# EAGLE schematic synth-a-phone-v1.0 (EAGLE 5.11)
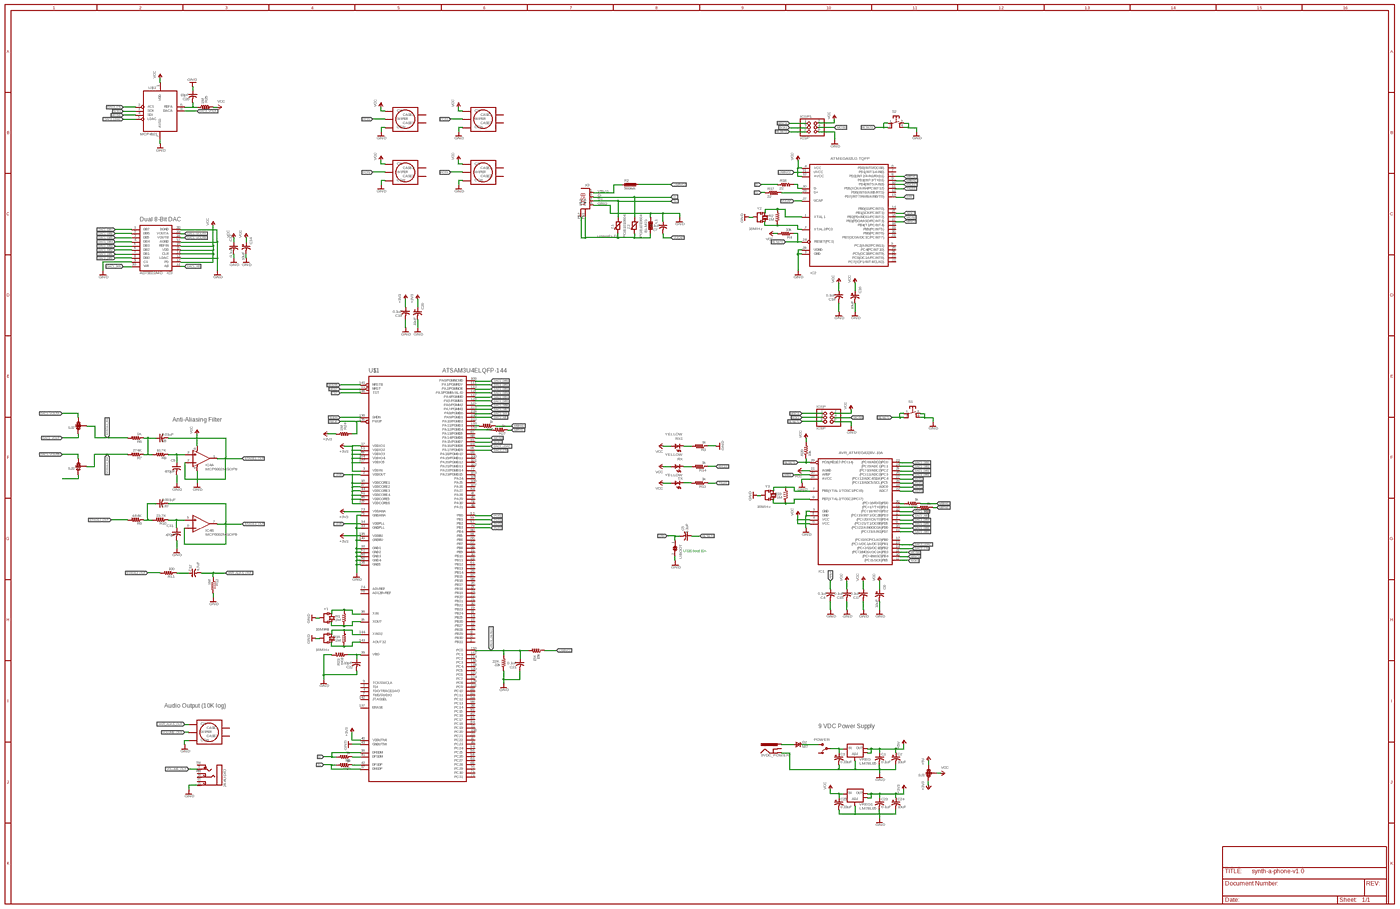
[diagram p0: schematic, sheet 1, overview]
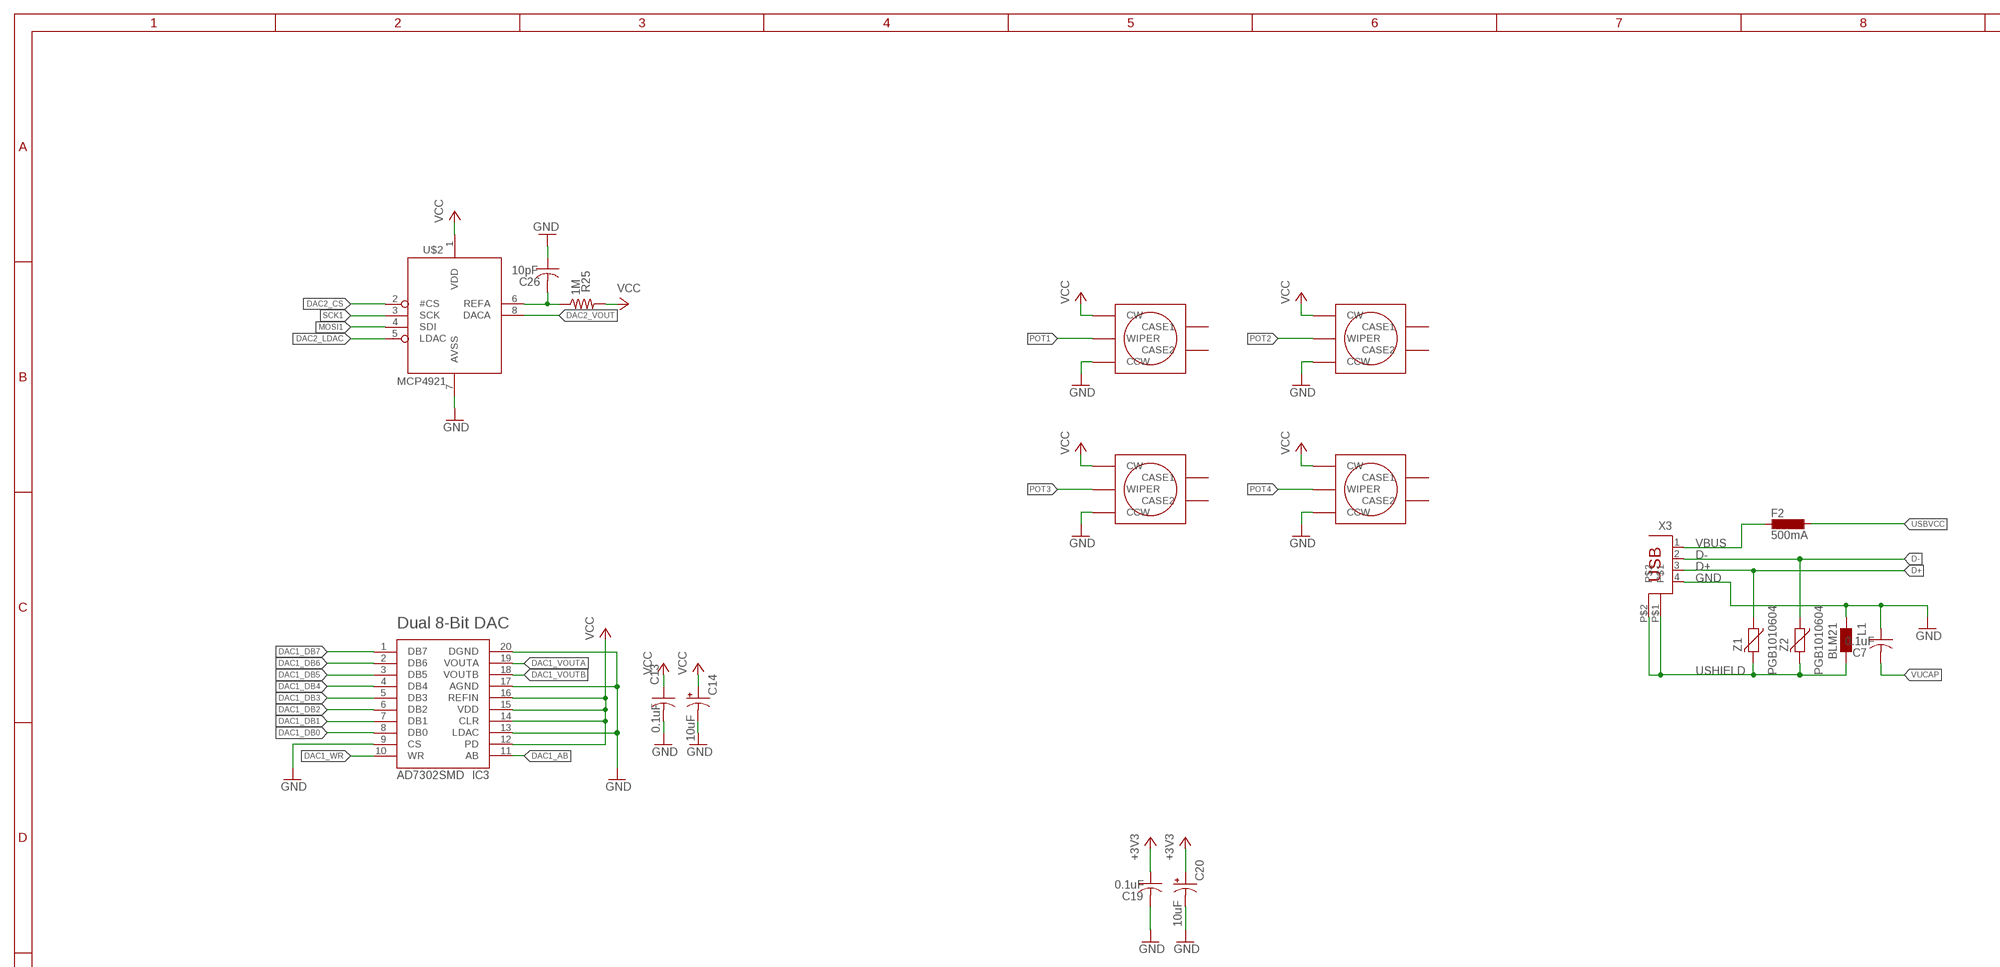
[diagram p1: schematic, sheet 1, part 1 of 4]
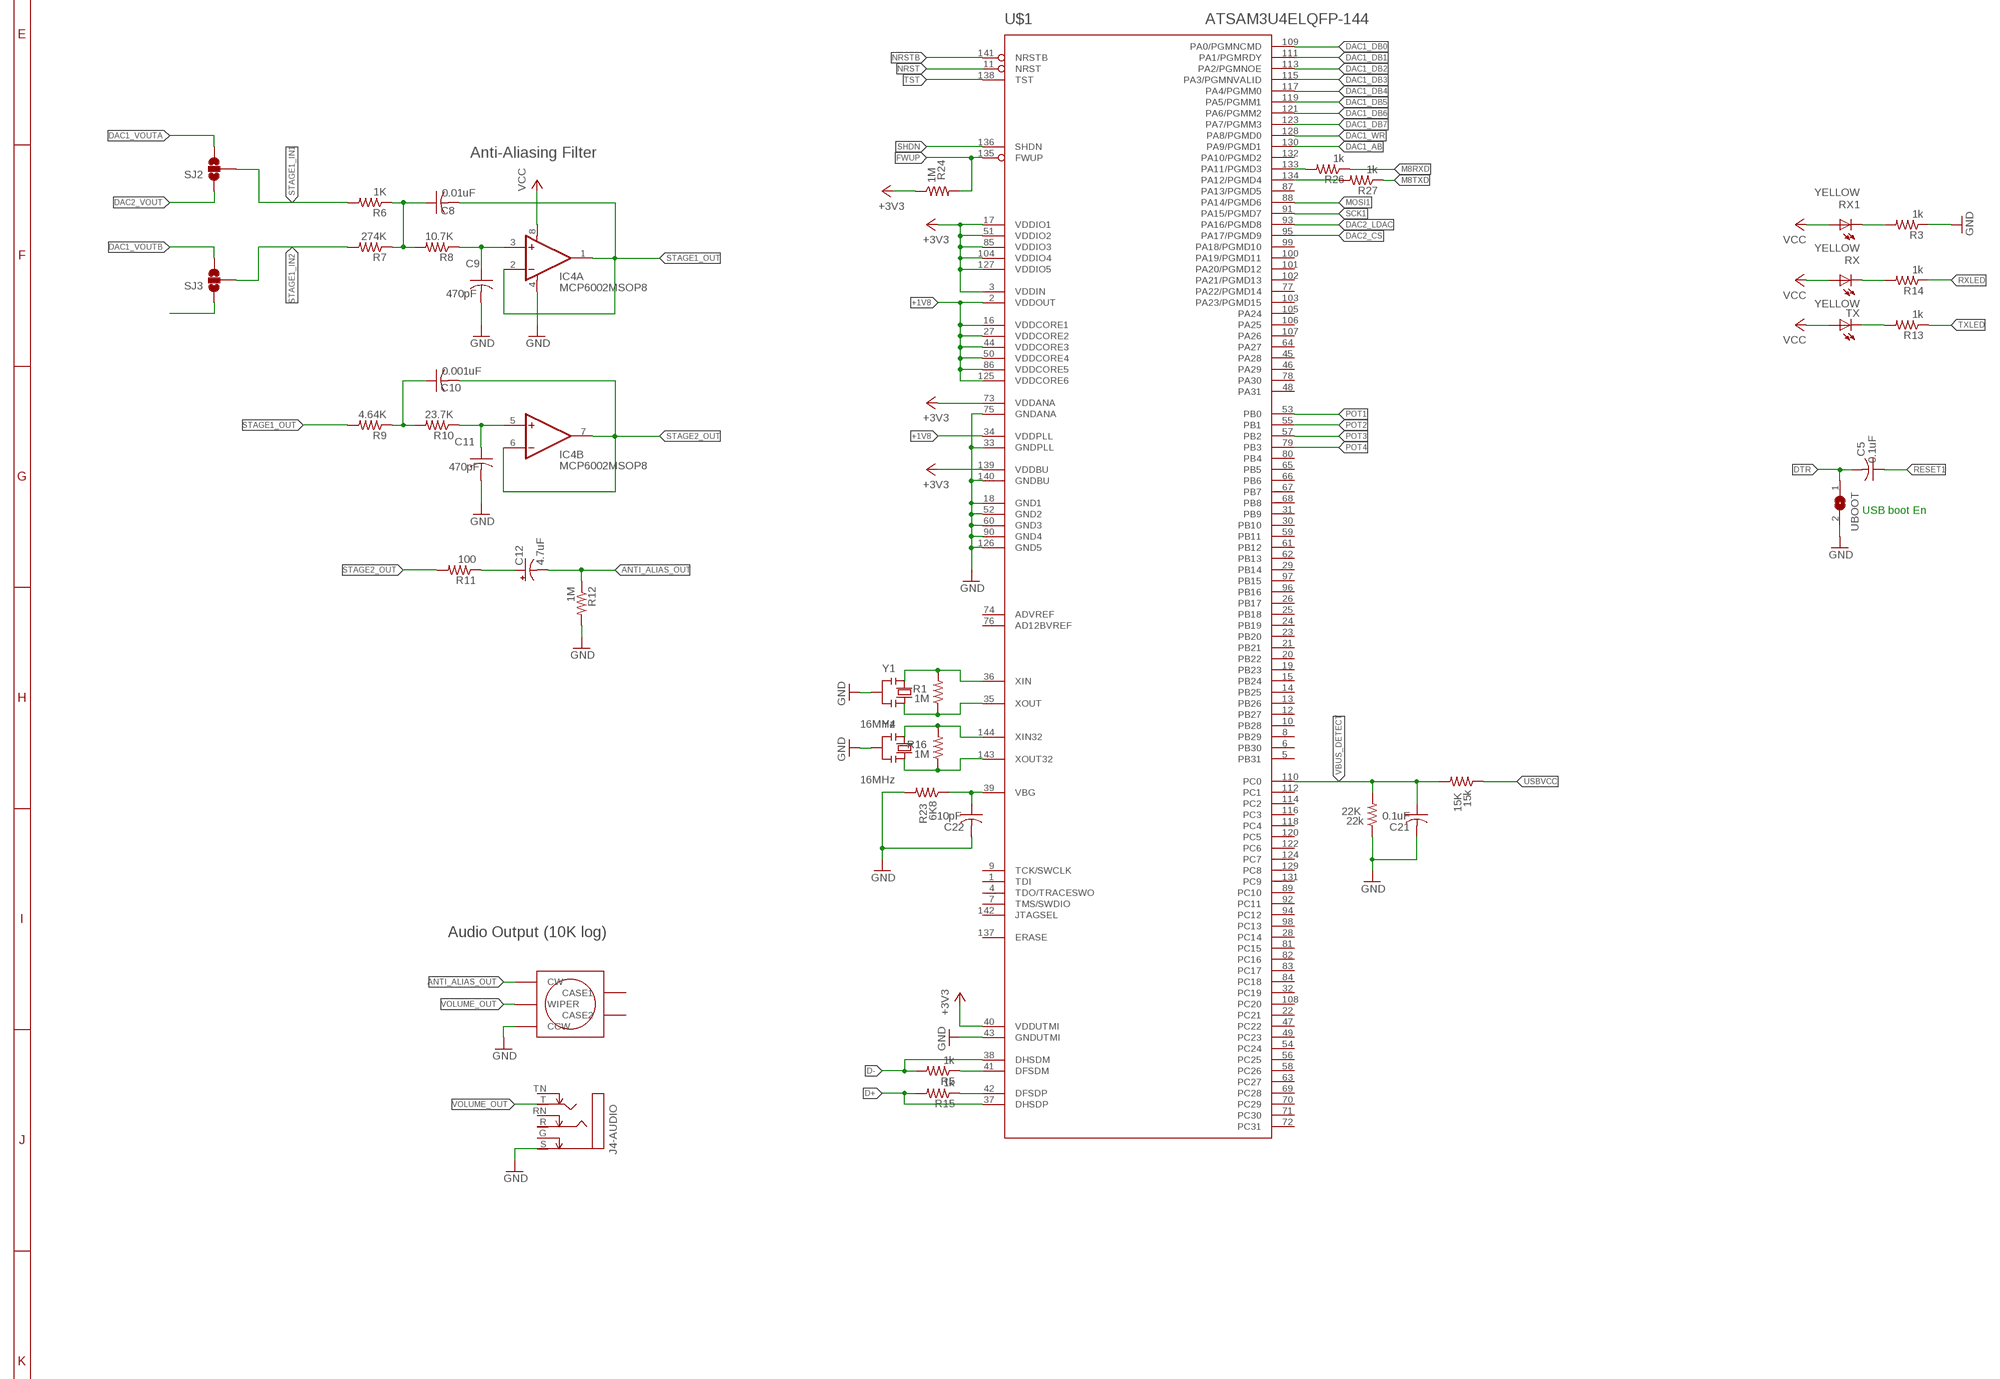
[diagram p2: schematic, sheet 1, part 2 of 4]
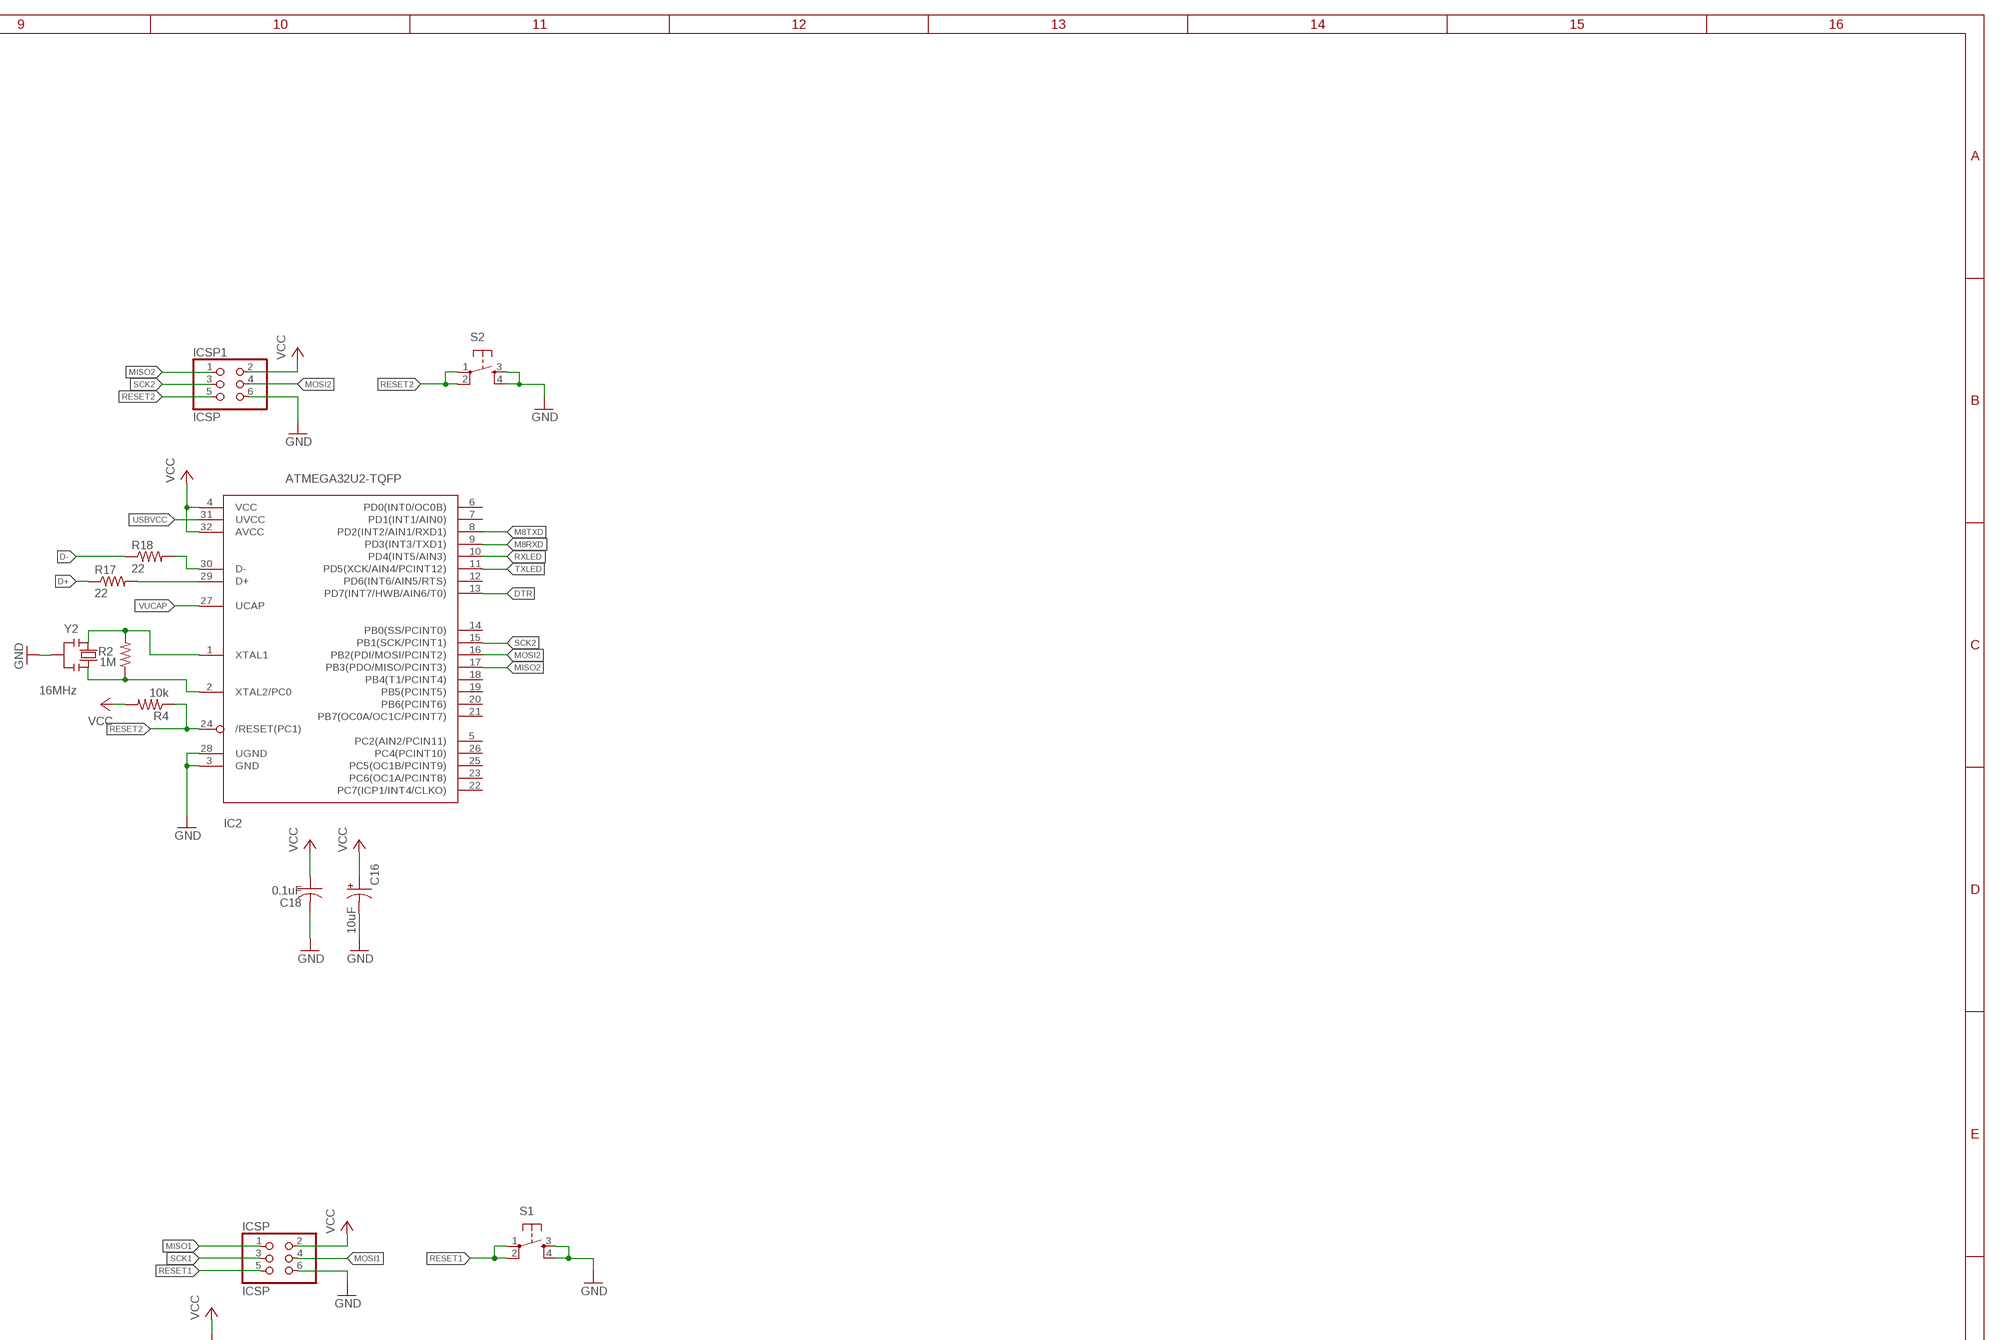
[diagram p3: schematic, sheet 1, part 3 of 4]
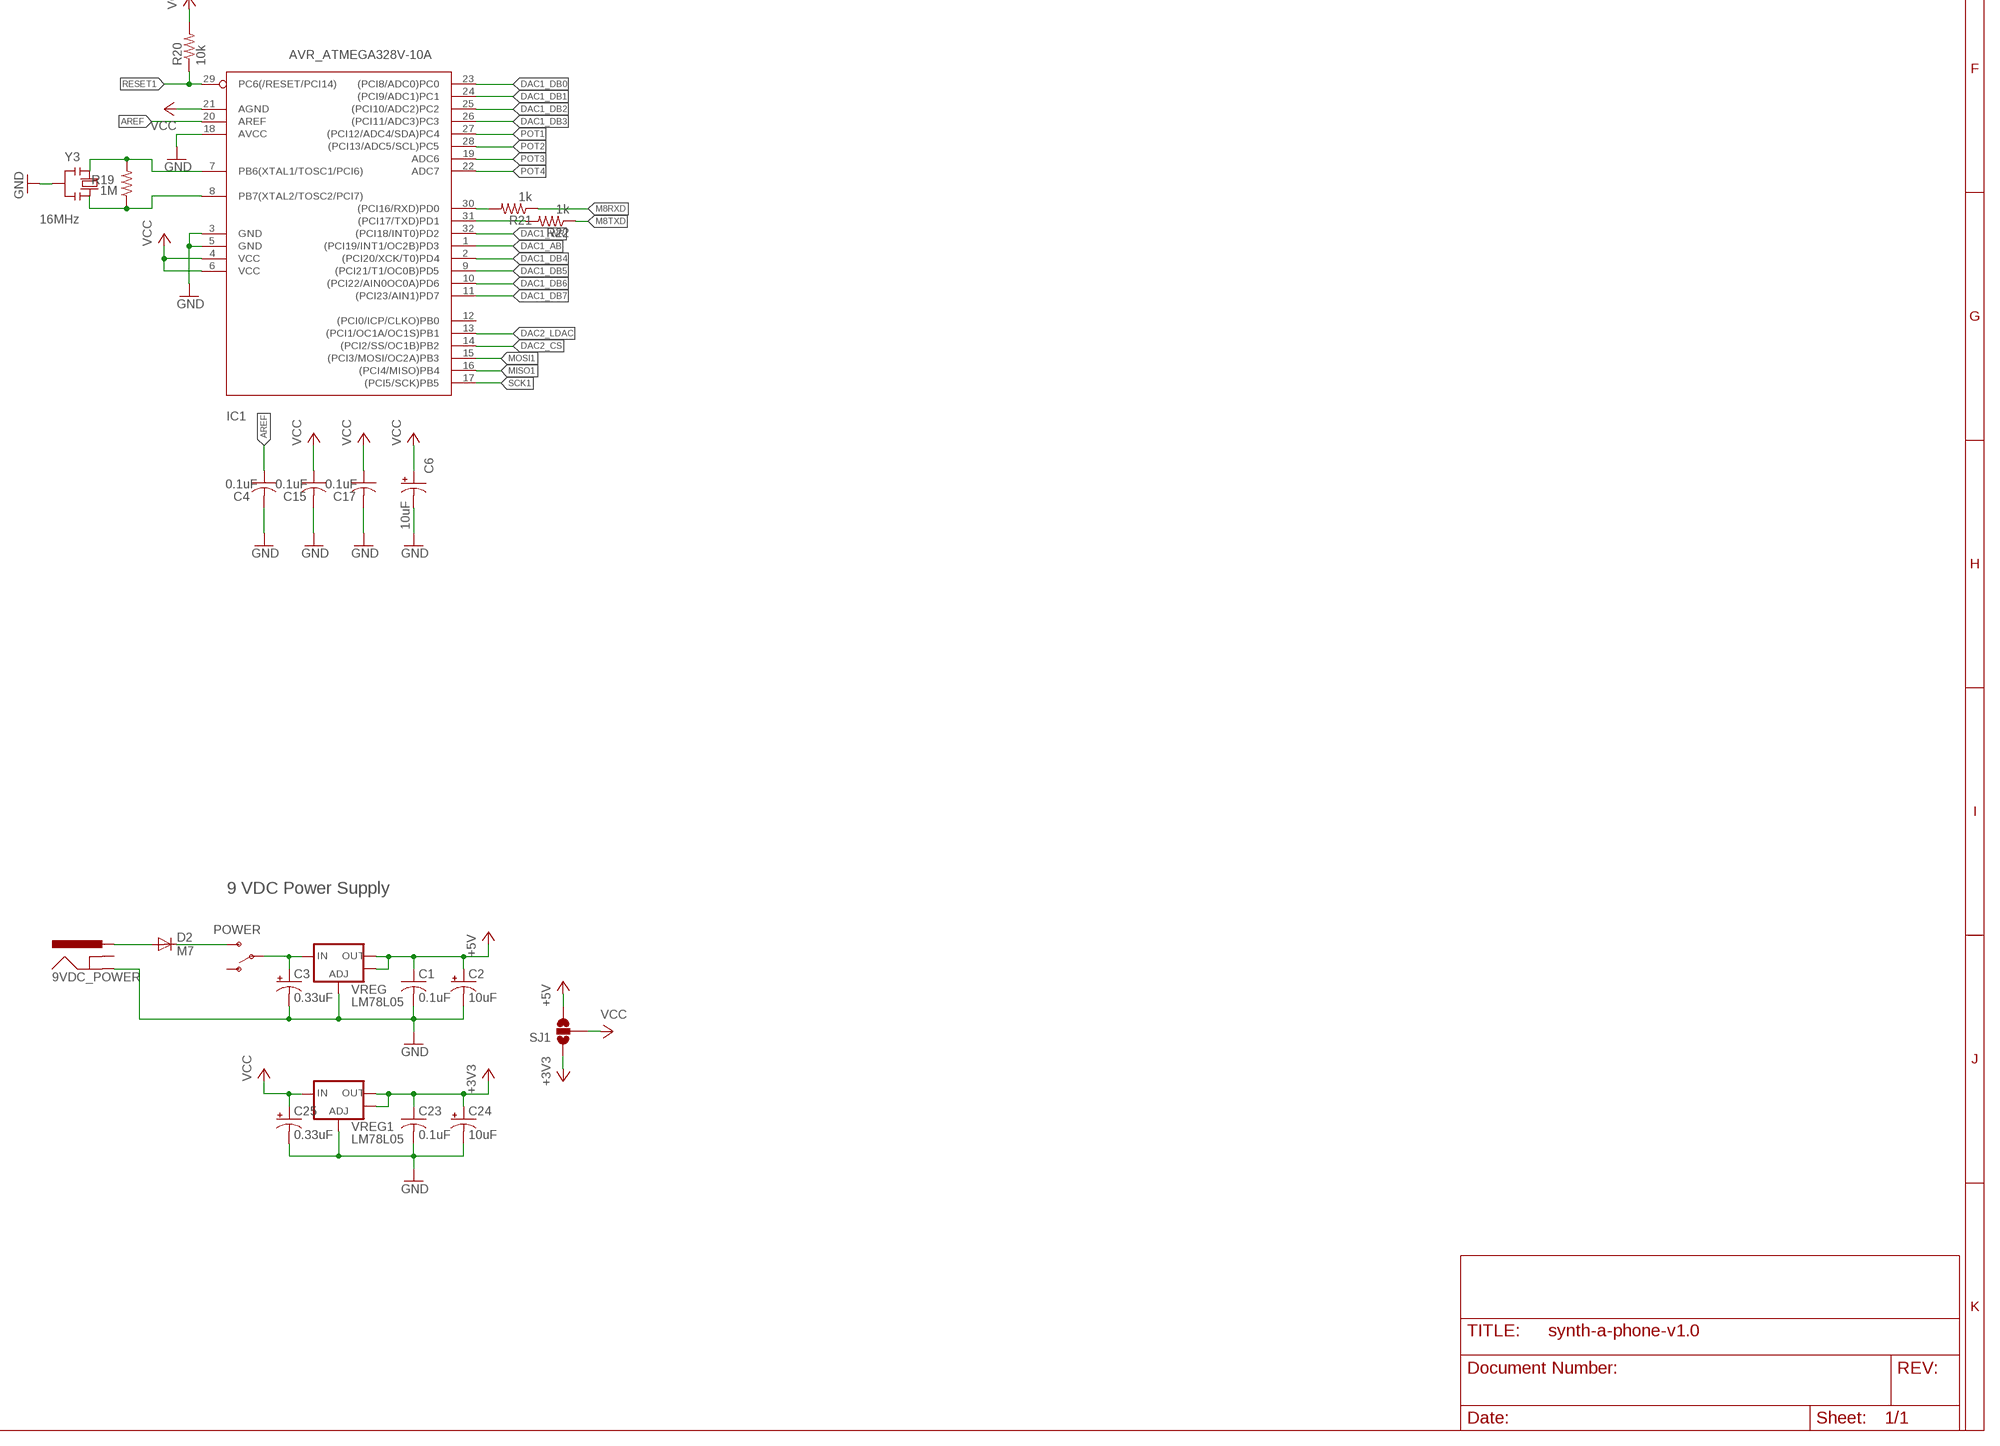
[diagram p4: schematic, sheet 1, part 4 of 4]

## Parts
9VDC_POWER  POWER_JACKPTH  [POWER_JACK_PTH]
15K  15k  R-US_R0603  [R0603]
22K  22k  R-US_R0603  [R0603]
C1  0.1uF  C-USC0603  [C0603]
C2  10uF  CPOL-USSMCA  [SMC_A]
C3  0.33uF  CPOL-USSMCA  [SMC_A]
C4  0.1uF  C-USC0603  [C0603]
C5  0.1uF  C-USC0603  [C0603]
C6  10uF  CPOL-USSMCA  [SMC_A]
C7  0.1uF  C-USC0603  [C0603]
C8  0.01uF  C-USC0603  [C0603]
C9  470pF  C-USC0603  [C0603]
C10  0.001uF  C-USC0603  [C0603]
C11  470pF  C-USC0603  [C0603]
C12  4.7uF  CPOL-USSMCA  [SMC_A]
C13  0.1uF  C-USC0603  [C0603]
C14  10uF  CPOL-USSMCA  [SMC_A]
C15  0.1uF  C-USC0603  [C0603]
C16  10uF  CPOL-USSMCA  [SMC_A]
C17  0.1uF  C-USC0603  [C0603]
C18  0.1uF  C-USC0603  [C0603]
C19  0.1uF  C-USC0603  [C0603]
C20  10uF  CPOL-USSMCA  [SMC_A]
C21  0.1uF  C-USC0603  [C0603]
C22  10pF  C-USC0603  [C0603]
C23  0.1uF  C-USC0603  [C0603]
C24  10uF  CPOL-USSMCA  [SMC_A]
C25  0.33uF  CPOL-USSMCA  [SMC_A]
C26  10pF  C-USC0603  [C0603]
D2  M7  DIODE-SMB  [SMB]
F2  500mA  L-EUL1812  [L1812]
IC1  AVR_ATMEGA328V-10A  [AVR_TQFP32-08]
IC2  ATMEGA32U2-TQFP  [TQFP32-08]
IC3  AD7302SMD  [TSSOP20]
IC4  MCP6002MSOP8  [MSOP8]
ICSP  ICSP  PINHD-2X3  [2X03]
ICSP1  ICSP  PINHD-2X3  [2X03]
J4-AUDIO  STEREOSWL  [NRJ6HF-1]
L1  BLM21  WE-CBF_0805  [0805]
POWER  SPST  SWITCH-SPSTPTH  [SWITCH-SPDT]
R1  1M  R-US_R0603  [R0603]
R2  1M  R-US_R0603  [R0603]
R3  1k  R-US_R0603  [R0603]
R4  10k  R-US_R0603  [R0603]
R5  1k  R-US_R0603  [R0603]
R6  1K  R-US_R0603  [R0603]
R7  274K  R-US_R0603  [R0603]
R8  10.7K  R-US_R0603  [R0603]
R9  4.64K  R-US_R0603  [R0603]
R10  23.7K  R-US_R0603  [R0603]
R11  100  R-US_R0603  [R0603]
R12  1M  R-US_R0603  [R0603]
R13  1k  R-US_R0603  [R0603]
R14  1k  R-US_R0603  [R0603]
R15  1k  R-US_R0603  [R0603]
R16  1M  R-US_R0603  [R0603]
R17  22  R-US_R0603  [R0603]
R18  22  R-US_R0603  [R0603]
R19  1M  R-US_R0603  [R0603]
R20  10k  R-US_R0603  [R0603]
R21  1k  R-US_R0603  [R0603]
R22  1k  R-US_R0603  [R0603]
R23  6K8  R-US_R0603  [R0603]
R24  1M  R-US_R0603  [R0603]
R25  1M  R-US_R0603  [R0603]
R26  1k  R-US_R0603  [R0603]
R27  1k  R-US_R0603  [R0603]
RX  YELLOW  LEDCHIP-LED0805  [CHIP-LED0805]
RX1  YELLOW  LEDCHIP-LED0805  [CHIP-LED0805]
S1  TAC_SWITCHPTH  [TACTILE-PTH]
S2  TAC_SWITCHPTH  [TACTILE-PTH]
SJ1  SOLDERJUMPER_2WAYS  [SJ_3]
SJ2  SOLDERJUMPER_2WAYS  [SJ_3]
SJ3  SOLDERJUMPER_2WAYS  [SJ_3]
TX  YELLOW  LEDCHIP-LED0805  [CHIP-LED0805]
U$1  ATSAM3U4ELQFP-144  [SQFP-S-20X20-144]
U$2  MCP4921MSOP8  [MSOP8]
UBOOT  SJ  [SJ]
VOLUME  Volume  VACOLOCO_EVUFRK09_POT  [VACOLOCO_EVUF]
VOLUME1  Volume  VACOLOCO_EVUFRK09_POT  [VACOLOCO_EVUF]
VOLUME2  Volume  VACOLOCO_EVUFRK09_POT  [VACOLOCO_EVUF]
VOLUME3  Volume  VACOLOCO_EVUFRK09_POT  [VACOLOCO_EVUF]
VOLUME4  Volume  VACOLOCO_EVUFRK09_POT  [VACOLOCO_EVUF]
VREG  LM78L05  V_REG_LM1117SOT223  [SOT223]
VREG1  LM78L05  V_REG_LM1117SOT223  [SOT223]
X3  PN61729  [PN61729]
Y1  16MHz  RESONATORMU  [RESONATOR]
Y2  16MHz  RESONATORMU  [RESONATOR]
Y3  16MHz  RESONATORMU  [RESONATOR]
Y4  16MHz  RESONATORMU  [RESONATOR]
Z1  PGB1010604  VARISTORCN0603  [CT/CN0603]
Z2  PGB1010604  VARISTORCN0603  [CT/CN0603]

## Nets
+1V8: U$1.2(VDDOUT) U$1.16(VDDCORE1) U$1.27(VDDCORE2) U$1.34(VDDPLL) U$1.44(VDDCORE3) U$1.50(VDDCORE4) U$1.86(VDDCORE5) U$1.125(VDDCORE6)
+3V3: C19.1 C20.+ C23.1 C24.+ R24.1 SJ1.1 U$1.3(VDDIN) U$1.17(VDDIO1) U$1.40(VDDUTMI) U$1.51(VDDIO2) U$1.73(VDDANA) U$1.85(VDDIO3) U$1.104(VDDIO4) U$1.127(VDDIO5) U$1.139(VDDBU) VREG1.2(OUT) VREG1.4(OUT)
+5V: C1.1 C2.+ SJ1.3 VREG.2(OUT) VREG.4(OUT)
ANTI_ALIAS_OUT: C12.- R12.1 VOLUME.CW
AREF: C4.1 IC1.20(AREF)
D+: R15.2 R17.1 U$1.37(DHSDP) X3.3 Z1.1
D-: R5.2 R18.1 U$1.38(DHSDM) X3.2 Z2.1
DAC1_AB: IC1.1((PCI19/INT1/OC2B)PD3) IC3.11(AB) U$1.130(PA9/PGMD1)
DAC1_DB0: IC1.23((PCI8/ADC0)PC0) IC3.8(DB0) U$1.109(PA0/PGMNCMD)
DAC1_DB1: IC1.24((PCI9/ADC1)PC1) IC3.7(DB1) U$1.111(PA1/PGMRDY)
DAC1_DB2: IC1.25((PCI10/ADC2)PC2) IC3.6(DB2) U$1.113(PA2/PGMNOE)
DAC1_DB3: IC1.26((PCI11/ADC3)PC3) IC3.5(DB3) U$1.115(PA3/PGMNVALID)
DAC1_DB4: IC1.2((PCI20/XCK/T0)PD4) IC3.4(DB4) U$1.117(PA4/PGMM0)
DAC1_DB5: IC1.9((PCI21/T1/OC0B)PD5) IC3.3(DB5) U$1.119(PA5/PGMM1)
DAC1_DB6: IC1.10((PCI22/AIN0OC0A)PD6) IC3.2(DB6) U$1.121(PA6/PGMM2)
DAC1_DB7: IC1.11((PCI23/AIN1)PD7) IC3.1(DB7) U$1.123(PA7/PGMM3)
DAC1_VOUTA: IC3.19(VOUTA) SJ2.3
DAC1_VOUTB: IC3.18(VOUTB) SJ3.3
DAC1_WR: IC1.32((PCI18/INT0)PD2) IC3.10(WR) U$1.128(PA8/PGMD0)
DAC2_CS: IC1.14((PCI2/SS/OC1B)PB2) U$1.95(PA17/PGMD9) U$2.2(#CS)
DAC2_LDAC: IC1.13((PCI1/OC1A/OC1S)PB1) U$1.93(PA16/PGMD8) U$2.5(LDAC)
DAC2_VOUT: SJ2.1 U$2.8(DACA)
DTR: C5.2 IC2.13(PD7(INT7/HWB/AIN6/T0)) UBOOT.1
FWUP: R24.2 U$1.135(FWUP)
GND: 9VDC_POWER.GND 22K.1 C1.2 C2.- C3.- C4.2 C6.- C7.1 C9.2 C11.2 C13.2 C14.- C15.2 C16.- C17.2 C18.2 C19.2 C20.- C21.2 C22.2 C23.2 C24.- C25.- C26.1 IC1.3(GND) IC1.5(GND) IC1.18(AVCC) IC2.3(GND) IC2.28(UGND) IC3.9(CS) IC3.13(LDAC) IC3.17(AGND) IC3.20(DGND) IC4.4(A:V-) ICSP1.6 ICSP.6 J4-AUDIO.S L1.1 R3.1 R12.2 R23.2 S1.3 S1.4 S2.3 S2.4 U$1.18(GND1) U$1.33(GNDPLL) U$1.43(GNDUTMI) U$1.52(GND2) U$1.60(GND3) U$1.75(GNDANA) U$1.90(GND4) U$1.126(GND5) U$1.140(GNDBU) U$2.7(AVSS) UBOOT.2 VOLUME1.CCW VOLUME2.CCW VOLUME3.CCW VOLUME4.CCW VOLUME.CCW VREG1.1(ADJ) VREG.1(ADJ) X3.4 Y1.2 Y2.2 Y3.2 Y4.2
M8RXD: IC2.9(PD3(INT3/TXD1)) R21.1 R26.1
M8TXD: IC2.8(PD2(INT2/AIN1/RXD1)) R22.1 R27.1
MISO1: IC1.16((PCI4/MISO)PB4) ICSP.1
MISO2: IC2.17(PB3(PDO/MISO/PCINT3)) ICSP1.1
MOSI1: IC1.15((PCI3/MOSI/OC2A)PB3) ICSP.4 U$1.88(PA14/PGMD6) U$2.4(SDI)
MOSI2: IC2.16(PB2(PDI/MOSI/PCINT2)) ICSP1.4
N$1: R5.1 U$1.41(DFSDM)
N$2: R15.1 U$1.42(DFSDP)
N$3: R14.2 RX.C
N$4: R13.2 TX.C
N$5: C22.1 R23.1 U$1.39(VBG)
N$6: R3.2 RX1.C
N$7: R26.2 U$1.133(PA11/PGMD3)
N$8: IC1.30((PCI16/RXD)PD0) R21.2
N$9: IC1.31((PCI17/TXD)PD1) R22.2
N$10: R27.2 U$1.134(PA12/PGMD4)
N$12: SJ3.1
N$15: C26.2 R25.1 U$2.6(REFA)
N$21: C12.+ R11.1
N$25: 9VDC_POWER.PWR D2.A
N$27: C3.+ POWER.2(P) VREG.3(IN)
N$42: D2.C POWER.3(S)
N$69: C8.1 R6.1 R7.1 R8.2
N$71: C9.1 IC4.3(A:+IN) R8.1
N$73: C10.1 R9.1 R10.2
N$74: C11.1 IC4.5(B:+IN) R10.1
NRST: U$1.11(NRST)
NRSTB: U$1.141(NRSTB)
POT1: IC1.27((PCI12/ADC4/SDA)PC4) U$1.53(PB0) VOLUME4.WIPER
POT2: IC1.28((PCI13/ADC5/SCL)PC5) U$1.55(PB1) VOLUME2.WIPER
POT3: IC1.19(ADC6) U$1.57(PB2) VOLUME3.WIPER
POT4: IC1.22(ADC7) U$1.79(PB3) VOLUME1.WIPER
RD+: IC2.29(D+) R17.2
RD-: IC2.30(D-) R18.2
RESET1: C5.1 IC1.29(PC6(/RESET/PCI14)) ICSP.5 R20.1 S1.1 S1.2
RESET2: IC2.24(/RESET(PC1)) ICSP1.5 R4.1 S2.1 S2.2
RXLED: IC2.10(PD4(INT5/AIN3)) R14.1
SCK1: IC1.17((PCI5/SCK)PB5) ICSP.3 U$1.91(PA15/PGMD7) U$2.3(SCK)
SCK2: IC2.15(PB1(SCK/PCINT1)) ICSP1.3
SHDN: U$1.136(SHDN)
STAGE1_IN1: R6.2 SJ2.2
STAGE1_IN2: R7.2 SJ3.2
STAGE1_OUT: C8.2 IC4.1(A:OUT) IC4.2(A:-IN) R9.2
STAGE2_OUT: C10.2 IC4.6(B:-IN) IC4.7(B:OUT) R11.2
TST: U$1.138(TST)
TXLED: IC2.11(PD5(XCK/AIN4/PCINT12)) R13.1
USBVCC: 15K.1 F2.1 IC2.31(UVCC)
USHIELD: L1.2 X3.P$1 X3.P$2 Z1.2 Z2.2
VBUS: F2.2 X3.1
VBUS_DETECT: 15K.2 22K.2 C21.1 U$1.110(PC0)
VCC: C6.+ C13.1 C14.+ C15.1 C16.+ C17.1 C18.1 C25.+ IC1.4(VCC) IC1.6(VCC) IC1.21(AGND) IC2.4(VCC) IC2.32(AVCC) IC3.12(PD) IC3.14(CLR) IC3.15(VDD) IC3.16(REFIN) IC4.8(A:V+) ICSP1.2 ICSP.2 R4.2 R20.2 R25.2 RX1.A RX.A SJ1.2 TX.A VOLUME1.CW VOLUME2.CW VOLUME3.CW VOLUME4.CW VREG1.3(IN)
VDD: U$2.1(VDD) ; supply symbol labelled VCC
VOLUME_OUT: J4-AUDIO.T VOLUME.WIPER
VUCAP: C7.2 IC2.27(UCAP)
XTAL1: IC2.1(XTAL1) R2.2 Y2.1
XTAL2: IC2.2(XTAL2/PC0) R2.1 Y2.3
XTAL3: R1.2 U$1.36(XIN) Y1.1
XTAL4: R1.1 U$1.35(XOUT) Y1.3
XTAL5: IC1.7(PB6(XTAL1/TOSC1/PCI6)) R19.2 Y3.1
XTAL6: IC1.8(PB7(XTAL2/TOSC2/PCI7)) R19.1 Y3.3
XTAL7: R16.2 U$1.144(XIN32) Y4.1
XTAL8: R16.1 U$1.143(XOUT32) Y4.3
Unconnected: 9VDC_POWER.GNDBREAK IC1.12((PCI0/ICP/CLKO)PB0) IC2.5(PC2(AIN2/PCIN11)) IC2.6(PD0(INT0/OC0B)) IC2.7(PD1(INT1/AIN0)) IC2.12(PD6(INT6/AIN5/RTS)) IC2.14(PB0(SS/PCINT0)) IC2.18(PB4(T1/PCINT4)) IC2.19(PB5(PCINT5)) IC2.20(PB6(PCINT6)) IC2.21(PB7(OC0A/OC1C/PCINT7)) IC2.22(PC7(ICP1/INT4/CLKO)) IC2.23(PC6(OC1A/PCINT8)) IC2.25(PC5(OC1B/PCINT9)) IC2.26(PC4(PCINT10)) J4-AUDIO.G(SN) J4-AUDIO.R J4-AUDIO.RN J4-AUDIO.TN POWER.1(O) U$1.1(TDI) U$1.4(TDO/TRACESWO) U$1.5(PB31) U$1.6(PB30) U$1.7(TMS/SWDIO) U$1.8(PB29) U$1.9(TCK/SWCLK) U$1.10(PB28) U$1.12(PB27) U$1.13(PB26) U$1.14(PB25) U$1.15(PB24) U$1.19(PB23) U$1.20(PB22) U$1.21(PB21) U$1.22(PC21) U$1.23(PB20) U$1.24(PB19) U$1.25(PB18) U$1.26(PB17) U$1.28(PC14) U$1.29(PB14) U$1.30(PB10) U$1.31(PB9) U$1.32(PC19) U$1.45(PA28) U$1.46(PA29) U$1.47(PC22) U$1.48(PA31) U$1.49(PC23) U$1.54(PC24) U$1.56(PC25) U$1.58(PC26) U$1.59(PB11) U$1.61(PB12) U$1.62(PB13) U$1.63(PC27) U$1.64(PA27) U$1.65(PB5) U$1.66(PB6) U$1.67(PB7) U$1.68(PB8) U$1.69(PC28) U$1.70(PC29) U$1.71(PC30) U$1.72(PC31) U$1.74(ADVREF) U$1.76(AD12BVREF) U$1.77(PA22/PGMD14) U$1.78(PA30) U$1.80(PB4) U$1.81(PC15) U$1.82(PC16) U$1.83(PC17) U$1.84(PC18) U$1.87(PA13/PGMD5) U$1.89(PC10) U$1.92(PC11) U$1.94(PC12) U$1.96(PB16) U$1.97(PB15) U$1.98(PC13) U$1.99(PA18/PGMD10) U$1.100(PA19/PGMD11) U$1.101(PA20/PGMD12) U$1.102(PA21/PGMD13) U$1.103(PA23/PGMD15) U$1.105(PA24) U$1.106(PA25) U$1.107(PA26) U$1.108(PC20) U$1.112(PC1) U$1.114(PC2) U$1.116(PC3) U$1.118(PC4) U$1.120(PC5) U$1.122(PC6) U$1.124(PC7) U$1.129(PC8) U$1.131(PC9) U$1.132(PA10/PGMD2) U$1.137(ERASE) U$1.142(JTAGSEL) VOLUME1.CASE1 VOLUME1.CASE2 VOLUME2.CASE1 VOLUME2.CASE2 VOLUME3.CASE1 VOLUME3.CASE2 VOLUME4.CASE1 VOLUME4.CASE2 VOLUME.CASE1 VOLUME.CASE2

## Notes on the sheet
- Dual 8-Bit DAC
- Anti-Aliasing Filter
- USB boot En
- Audio Output (10K log)
- 9 VDC Power Supply

## Library data of the parts
9VDC_POWER = meeblip:POWER_JACK: Power Jack 5.5mm barrel jack for optional 9 VDC power input.
15K 22K R1-R27 = rcl:R-US_: RESISTOR, American symbol
C1 C4 C5 C7-C11 C13 C15 C17-C19 C21-C23 C26 = rcl:C-US: CAPACITOR, American symbol
C2 C3 C6 C12 C14 C16 C20 C24 C25 = rcl:CPOL-US: POLARIZED CAPACITOR, American symbol
D2 = diode:DIODE-: DIODE
F2 = rcl:L-EU: INDUCTOR, European symbol
IC1 = avr:AVR_ATMEGA328: MICROCONTROLLER 32 kBytes FLASH 1 kBytes SRAM 512 Bytes EEPROM USART 8-channel 10 bit ADC
IC2 = adafruit:ATMEGA32U2: ATmega32u2 Pin compatible with the atmega8u2, atmega16u2 and atmega32u2 8, 16 or 32 K flash, 1K RAM, 512b EEPROM 8 bit and 16 bit timer (5 PWM total) UART, SPI (no I2C!) USB with 4 endpoints, LUFA compatible 22 I/O lines, analog comparator (no ADC!) Comes with DFU bootloader burned in!
IC3 = SparkFun:AD7302: AD7302
IC4 = Sparky:MCP6002: Dual Op Amp
ICSP ICSP1 = pinhead:PINHD-2X3: PIN HEADER
J4-AUDIO = meeblip:STEREOSW: Neutrik Stereo 1/4" Jack Easy to obtain. The mono version is used in MeeBilp, it shares the same pinout.
L1 = wuerth-elektronik:WE-CBF: SMD EMI Suppression Ferrite Beads - excellent anti-EMI properties - low DCR - impedances till 3000 ohms - rated current up to 6 A
POWER = meeblip:SWITCH-SPST: SPDT Switch ON-ON slide switch. Mouser part #102-1221-EV
RX RX1 TX = led:LED: LED OSRAM: - CHIPLED LG R971, LG N971, LY N971, LG Q971, LY Q971, LO R971, LY R971 LH N974, LH R974 LS Q976, LO Q976, LY Q976 LO Q996 - Hyper CHIPLED LW Q18S LB Q993, LB Q99A, LB R99A - SideLED LS A670, LO A670, LY A670, LG A670, LP A670 LB A673, LV A673, LT A673, LW A673 LH A674 LY A675 LS A676, LA A676, LO A676, LY A676, LW A676 LS A679, LY A679, LG A679 - Hyper Micro SIDELED® LS Y876, LA Y876, LO Y876, LY Y876 LT Y87S - SmartLED LW L88C, LW L88S LB L89C, LB L89S, LG L890 LS L89K, LO L89K, LY L89K LS L896, LA L896, LO L896, LY L896 - TOPLED LS T670, LO T670, LY T670, LG T670, LP T670 LSG T670, LSP T670, LSY T670, LOP T670, LYG T670 LG T671, LOG T671, LSG T671 LB T673, LV T673, LT T673, LW T673 LH T674 LS T676, LA T676, LO T676, LY T676, LB T676, LH T676, LSB T676, LW T676 LB T67C, LV T67C, LT T67C, LS T67K, LO T67K, LY T67K, LW E67C LS E67B, LA E67B, LO E67B, LY E67B, LB E67C, LV E67C, LT E67C LW T67C LS T679, LY T679, LG T679 LS T770, LO T770, LY T770, LG T770, LP T770 LB T773, LV T773, LT T773, LW T773 LH T774 LS E675, LA E675, LY E675, LS T675 LS T776, LA T776, LO T776, LY T776, LB T776 LHGB T686 LT T68C, LB T68C - Hyper Mini TOPLED® LB M676 - Mini TOPLED Santana® LG M470 LS M47K, LO M47K, LY M47K Source: http://www.osram.convergy.de LUXEON: - LUMILED® LXK2-PW12-R00, LXK2-PW12-S00, LXK2-PW14-U00, LXK2-PW14-V00 LXK2-PM12-R00, LXK2-PM12-S00, LXK2-PM14-U00 LXK2-PE12-Q00, LXK2-PE12-R00, LXK2-PE12-S00, LXK2-PE14-T00, LXK2-PE14-U00 LXK2-PB12-K00, LXK2-PB12-L00, LXK2-PB12-M00, LXK2-PB14-N00, LXK2-PB14-P00, LXK2-PB14-Q00 LXK2-PR12-L00, LXK2-PR12-M00, LXK2-PR14-Q00, LXK2-PR14-R00 LXK2-PD12-Q00, LXK2-PD12-R00, LXK2-PD12-S00 LXK2-PH12-R00, LXK2-PH12-S00 LXK2-PL12-P00, LXK2-PL12-Q00, LXK2-PL12-R00 Source: www.luxeon.com KINGBRIGHT: KA-3528ASYC Source: www.kingbright.com
S1 S2 = SparkFun:TAC_SWITCH: Momentary Switch Button commonly used for reset or general input. Spark Fun Electronics SKU : COM-00097
SJ1-SJ3 = SparkFun:SOLDERJUMPER_2WAY: Solder Jumper 2 way solder jumper
U$1 = Sparky:ATSAM3U4E
U$2 = Sparky:MCP4921
UBOOT = jumper:SJ: SMD solder JUMPER
VOLUME VOLUME1-VOLUME4 = meeblip:VACOLOCO_EVUF: Panasonic EVUF type potentionmeter Vertical Mount
VREG VREG1 = SparkFun:V_REG_LM1117: Voltage Regulator LM1117 Standard adjustable voltage regulator but in SMD form. Spark Fun Electronics SKU : COM-00595
X3 = SmartPrj:PN61729: BERG USB connector
Y1-Y4 = SmartPrj:RESONATOR
Z1 Z2 = varistor:VARISTOR: VARISTOR